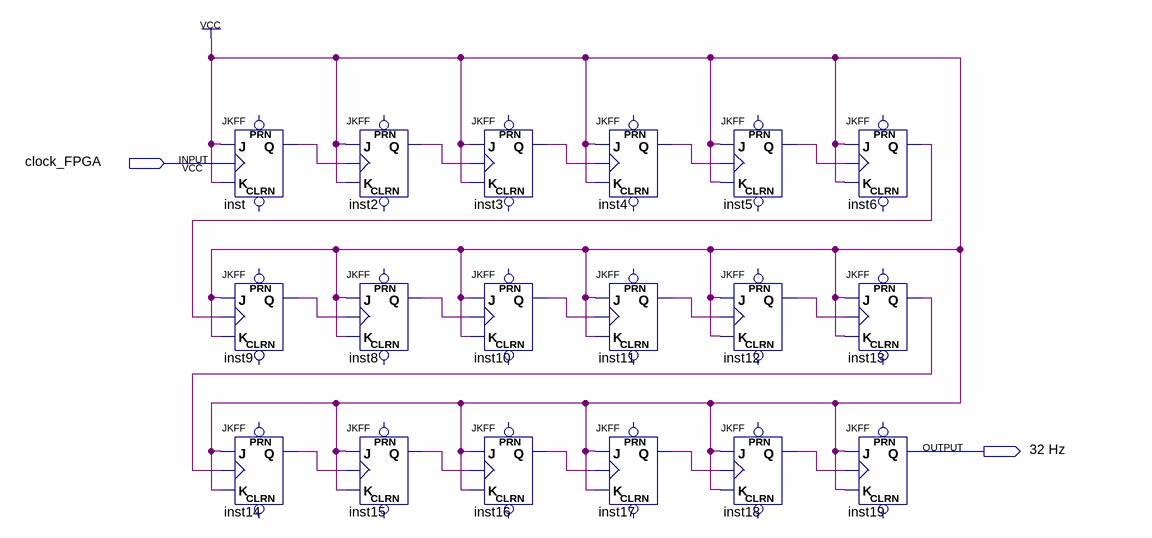
[diagram p0: schematic sheet]
// Quartus schematic divisor.bdf as structural Verilog: 18 symbols, 2 pins
module divisor (
  input  clock_FPGA,
  output \32_Hz 
);

  wire inst2_q, inst3_q, inst4_q, inst5_q, inst6_q, inst8_q, inst9_q, inst10_q, inst11_q, inst12_q, inst13_q,
       inst14_q, inst15_q, inst16_q, inst17_q, inst18_q, inst_q;

  JKFF inst (.K(1'b1), .J(1'b1), .CLK(clock_FPGA), .Q(inst_q));  // open: PRN, CLRN
  JKFF inst9 (.K(1'b1), .J(1'b1), .CLK(inst6_q), .Q(inst9_q));  // open: PRN, CLRN
  JKFF inst14 (.K(1'b1), .J(1'b1), .CLK(inst13_q), .Q(inst14_q));  // open: PRN, CLRN
  JKFF inst2 (.K(1'b1), .J(1'b1), .CLK(inst_q), .Q(inst2_q));  // open: PRN, CLRN
  JKFF inst8 (.K(1'b1), .J(1'b1), .CLK(inst9_q), .Q(inst8_q));  // open: PRN, CLRN
  JKFF inst15 (.K(1'b1), .J(1'b1), .CLK(inst14_q), .Q(inst15_q));  // open: PRN, CLRN
  JKFF inst3 (.K(1'b1), .J(1'b1), .CLK(inst2_q), .Q(inst3_q));  // open: PRN, CLRN
  JKFF inst10 (.K(1'b1), .J(1'b1), .CLK(inst8_q), .Q(inst10_q));  // open: PRN, CLRN
  JKFF inst16 (.K(1'b1), .J(1'b1), .CLK(inst15_q), .Q(inst16_q));  // open: PRN, CLRN
  JKFF inst4 (.K(1'b1), .J(1'b1), .CLK(inst3_q), .Q(inst4_q));  // open: PRN, CLRN
  JKFF inst11 (.K(1'b1), .J(1'b1), .CLK(inst10_q), .Q(inst11_q));  // open: PRN, CLRN
  JKFF inst17 (.K(1'b1), .J(1'b1), .CLK(inst16_q), .Q(inst17_q));  // open: PRN, CLRN
  JKFF inst5 (.K(1'b1), .J(1'b1), .CLK(inst4_q), .Q(inst5_q));  // open: PRN, CLRN
  JKFF inst12 (.K(1'b1), .J(1'b1), .CLK(inst11_q), .Q(inst12_q));  // open: PRN, CLRN
  JKFF inst18 (.K(1'b1), .J(1'b1), .CLK(inst17_q), .Q(inst18_q));  // open: PRN, CLRN
  JKFF inst6 (.K(1'b1), .J(1'b1), .CLK(inst5_q), .Q(inst6_q));  // open: PRN, CLRN
  JKFF inst13 (.K(1'b1), .J(1'b1), .CLK(inst12_q), .Q(inst13_q));  // open: PRN, CLRN
  JKFF inst19 (.K(1'b1), .J(1'b1), .CLK(inst18_q), .Q(\32_Hz ));  // open: PRN, CLRN
endmodule
